# Altium schematic sheet 11 EXPANSION CN.SchDoc
size A3; Organization: Protel International P/L; Address1: L3, 12a Rodborough Rd; Address2: Frenchs Forest; Address3: NSW; Address4: Australia 2086; SheetNumber: 3; SheetTotal: 11
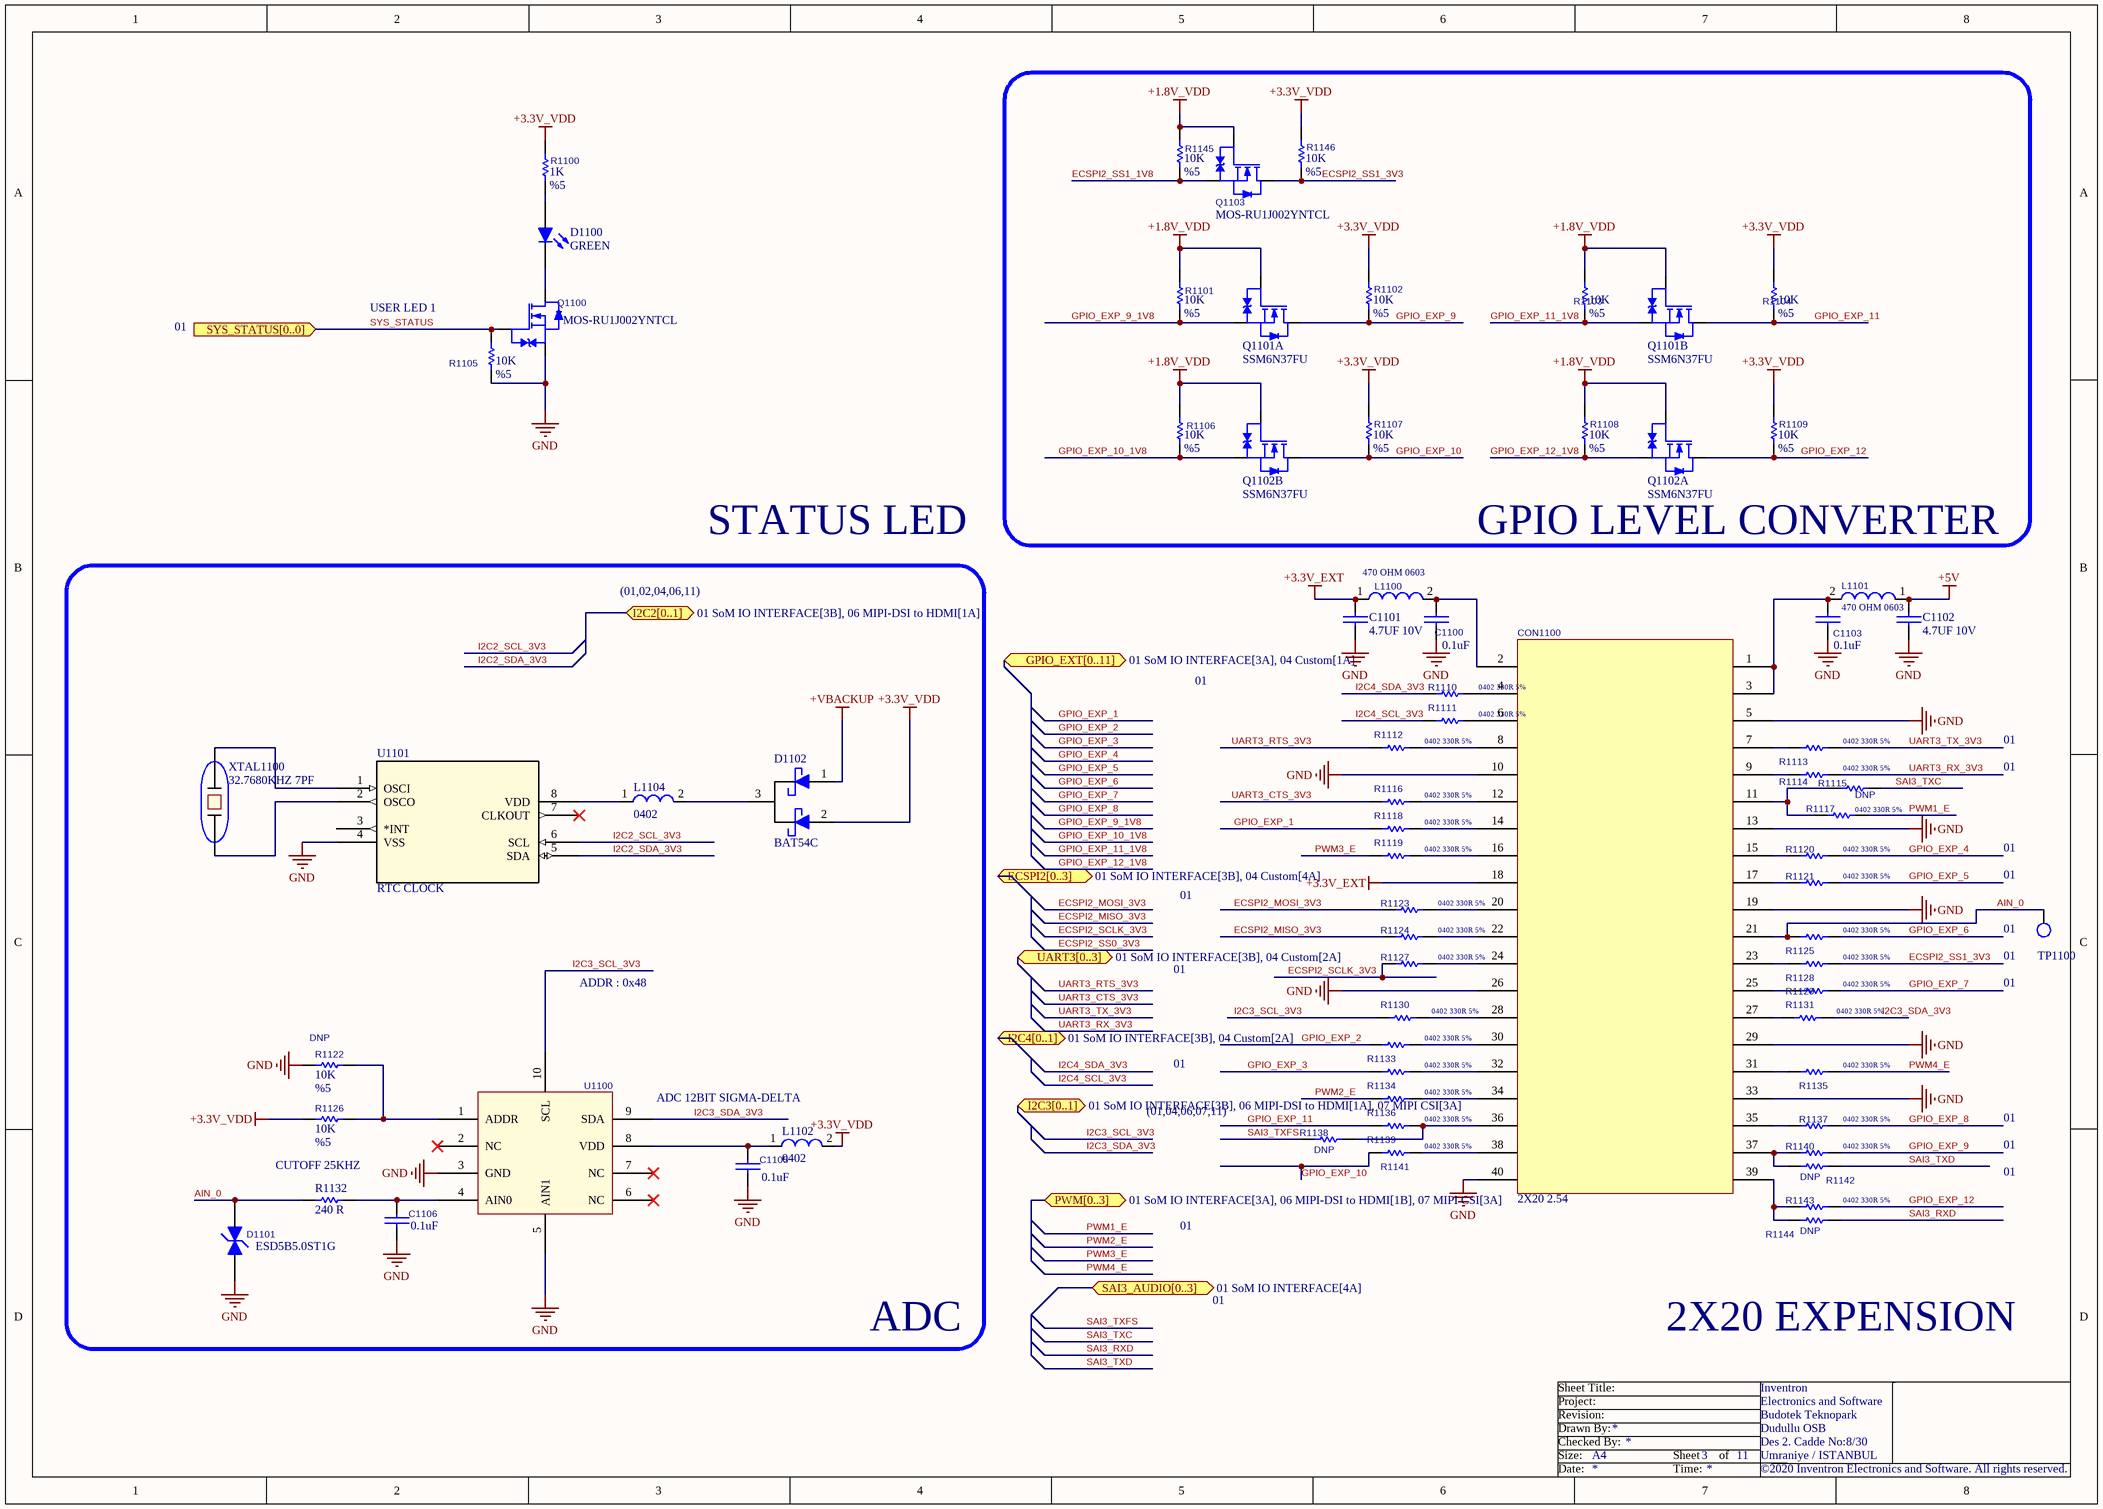
[diagram p0: 11 EXPANSION CN.SchDoc]

## Parts
C1100  0.1uF  [0402_CC]
C1101  4.7UF 10V  [0402_CC]
C1102  4.7UF 10V  [0402_CC]
C1103  0.1uF  [0402_CC]
C1105  0.1uF  [0402_CC]
C1106  0.1uF  [0402_CC]
CON1100  2X20 2.54  [HEADER 2.54mm X 2X20]
D1100  GREEN  [0603_LED]
D1101  ESD5B5.0ST1G  [SOD523 - SZESD]
D1102  BAT54C  [SOT23]
L1100  470 OHM 0603  [0603_RES]
L1101  470 OHM 0603  [0603_RES]
L1102  0402  [0402_RES]
L1104  0402  [0402_RES]
Q1100  MOS-RU1J002YNTCL  [SC-85-3/SOT-323FL]
Q1101  SSM6N37FU  [SOT-363]  (parts A,B of 2)
Q1102  SSM6N37FU  [SOT-363]  (parts A,B of 2)
Q1103  MOS-RU1J002YNTCL  [SC-85-3/SOT-323FL]
R1100  1K  Tolerance: %5  [0402_RES]
R1101  10K  Tolerance: %5  [0402_RES]
R1102  10K  Tolerance: %5  [0402_RES]
R1103  10K  Tolerance: %5  [0402_RES]
R1104  10K  Tolerance: %5  [0402_RES]
R1105  10K  Tolerance: %5  [0402_RES]
R1106  10K  Tolerance: %5  [0402_RES]
R1107  10K  Tolerance: %5  [0402_RES]
R1108  10K  Tolerance: %5  [0402_RES]
R1109  10K  Tolerance: %5  [0402_RES]
R1110  0402 330R 5%  [0402_RES]
R1111  0402 330R 5%  [0402_RES]
R1112  0402 330R 5%  [0402_RES]
R1113  0402 330R 5%  [0402_RES]
R1114  0402 330R 5%  [0402_RES]
R1115  ASSY_OPT: DNP  [0402_RES]  (hidden comment: 0402 330R 5%)  (no BOM)
R1116  0402 330R 5%  [0402_RES]
R1117  0402 330R 5%  [0402_RES]
R1118  0402 330R 5%  [0402_RES]
R1119  0402 330R 5%  [0402_RES]
R1120  0402 330R 5%  [0402_RES]
R1121  0402 330R 5%  [0402_RES]
R1122  10K  ASSY_OPT: DNP  Tolerance: %5  [0402_RES]  (no BOM)
R1123  0402 330R 5%  [0402_RES]
R1124  0402 330R 5%  [0402_RES]
R1125  0402 330R 5%  [0402_RES]
R1126  10K  Tolerance: %5  [0402_RES]
R1127  0402 330R 5%  [0402_RES]
R1128  0402 330R 5%  [0402_RES]
R1129  0402 330R 5%  [0402_RES]
R1130  0402 330R 5%  [0402_RES]
R1131  0402 330R 5%  [0402_RES]
R1132  240 R  [0402_RES]
R1133  0402 330R 5%  [0402_RES]
R1134  0402 330R 5%  [0402_RES]
R1135  0402 330R 5%  [0402_RES]
R1136  0402 330R 5%  [0402_RES]
R1137  0402 330R 5%  [0402_RES]
R1138  ASSY_OPT: DNP  [0402_RES]  (hidden comment: 0402 330R 5%)  (no BOM)
R1139  0402 330R 5%  [0402_RES]
R1140  0402 330R 5%  [0402_RES]
R1141  0402 330R 5%  [0402_RES]
R1142  ASSY_OPT: DNP  [0402_RES]  (hidden comment: 0402 330R 5%)  (no BOM)
R1143  0402 330R 5%  [0402_RES]
R1144  ASSY_OPT: DNP  [0402_RES]  (hidden comment: 0402 330R 5%)  (no BOM)
R1145  10K  Tolerance: %5  [0402_RES]
R1146  10K  Tolerance: %5  [0402_RES]
TP1100  TEST POINT 15  [testpoint_15]  (value not drawn)  (no BOM)
U1100  ADC 12BIT SIGMA-DELTA  [IC-TLA2022IRUGR]
U1101  RTC CLOCK  [PCF85063AT/AY]
XTAL1100  32.7680KHZ 7PF  [FC-135 32.768KA-AG0]

## Blocks framed on the sheet
GPIO LEVEL CONVERTER: Q1101-Q1103 R1101-R1104 R1106-R1109 R1145 R1146
ADC: C1105 C1106 D1101 D1102 L1102 L1104 R1122 R1126 R1132 U1100 U1101 XTAL1100

## Ports
ECSPI2[0..3] (bidir, see 01 SoM IO INTERFACE[3B], 04 Custom[4A]), GPIO_EXT[0..11] (bidir, see 01 SoM IO INTERFACE[3A], 04 Custom[1A]), I2C2[0..1] (bidir, see 01 SoM IO INTERFACE[3B], 06 MIPI-DSI to HDMI[1A]), I2C3[0..1] (bidir, see 01 SoM IO INTERFACE[3B], 06 MIPI-DSI to HDMI[1A], 07 MIPI CSI[3A]), I2C4[0..1] (bidir, see 01 SoM IO INTERFACE[3B], 04 Custom[2A]), PWM[0..3] (bidir, see 01 SoM IO INTERFACE[3A], 06 MIPI-DSI to HDMI[1B], 07 MIPI CSI[3A]), SAI3_AUDIO[0..3] (bidir, see 01 SoM IO INTERFACE[4A]), SYS_STATUS[0..0] (in), UART3[0..3] (bidir, see 01 SoM IO INTERFACE[3B], 04 Custom[2A])

## Nets
+1.8V_VDD: Q1101.2(G) Q1101.5(G) Q1102.2(G) Q1102.5(G) Q1103.1(G) R1101.2 R1103.2 R1106.2 R1108.2 R1145.2
+3.3V_EXT: C1101.1 CON1100.18 L1100.1
+3.3V_VDD: D1102.2 L1102.2 R1100.1 R1102.2 R1104.2 R1107.2 R1109.2 R1126.2 R1146.2
+5V: C1102.1 L1101.1
+VBACKUP: D1102.1
GND: C1100.2 C1101.2 C1102.2 C1103.2 C1105.2 C1106.1 CON1100.5 CON1100.10 CON1100.13 CON1100.19 CON1100.26 CON1100.29 CON1100.33 CON1100.40 D1101.1(A) Q1100.2(S) R1105.2 R1122.2 U1100.3(GND) U1100.5(AIN1) U1101.4(VSS)
AIN_0: CON1100.21 D1101.2(K) R1125.1 R1132.1 TP1100.1
ECSPI2_MISO_3V3: R1124.1
ECSPI2_MOSI_3V3: R1123.1
ECSPI2_SCLK_3V3: R1127.1
ECSPI2_SS1_1V8: Q1103.2(S) R1145.1
ECSPI2_SS1_3V3: Q1103.3(D) R1128.2 R1146.1
GPIO_EXP_1: R1118.1
GPIO_EXP_2: R1133.1
GPIO_EXP_3: R1134.1
GPIO_EXP_4: R1120.2
GPIO_EXP_5: R1121.2
GPIO_EXP_6: R1125.2
GPIO_EXP_7: R1131.2
GPIO_EXP_8: R1137.2
GPIO_EXP_9: Q1101.6(D) R1102.1 R1140.2
GPIO_EXP_9_1V8: Q1101.1(S) R1101.1
GPIO_EXP_10: Q1102.3(D) R1107.1 R1141.1
GPIO_EXP_10_1V8: Q1102.4(S) R1106.1
GPIO_EXP_11: Q1101.3(D) R1104.1 R1139.1
GPIO_EXP_11_1V8: Q1101.4(S) R1103.1
GPIO_EXP_12: Q1102.6(D) R1109.1 R1143.2
GPIO_EXP_12_1V8: Q1102.1(S) R1108.1
I2C2_SCL_3V3: U1101.6(SCL)
I2C2_SDA_3V3: U1101.5(SDA)
I2C3_SCL_3V3: R1130.1 U1100.10(SCL)
I2C3_SDA_3V3: R1129.2 U1100.9(SDA)
I2C4_SCL_3V3: R1111.1
I2C4_SDA_3V3: R1110.1
PWM1_E: R1117.2
PWM2_E: R1136.1
PWM3_E: R1119.1
PWM4_E: R1135.2
SAI3_RXD: R1144.2
SAI3_TXC: R1115.2
SAI3_TXD: R1142.2
SAI3_TXFS: R1138.1
SYS_STATUS: Q1100.1(G) R1105.1
UART3_CTS_3V3: R1116.1
UART3_RTS_3V3: R1112.1
UART3_RX_3V3: R1114.2
UART3_TX_3V3: R1113.2
NetC1100_1: C1100.1 CON1100.2 L1100.2
NetC1103_1: C1103.1 CON1100.1 CON1100.3 L1101.2
NetC1105_1: C1105.1 L1102.1 U1100.8(VDD)
NetC1106_2: C1106.2 R1132.2 U1100.4(AIN0)
NetCON1100_4: CON1100.4 R1110.2
NetCON1100_6: CON1100.6 R1111.2
NetCON1100_7: CON1100.7 R1113.1
NetCON1100_8: CON1100.8 R1112.2
NetCON1100_9: CON1100.9 R1114.1
NetCON1100_11: CON1100.11 R1115.1 R1117.1
NetCON1100_12: CON1100.12 R1116.2
NetCON1100_14: CON1100.14 R1118.2
NetCON1100_15: CON1100.15 R1120.1
NetCON1100_16: CON1100.16 R1119.2
NetCON1100_17: CON1100.17 R1121.1
NetCON1100_20: CON1100.20 R1123.2
NetCON1100_22: CON1100.22 R1124.2
NetCON1100_23: CON1100.23 R1128.1
NetCON1100_24: CON1100.24 R1127.2
NetCON1100_25: CON1100.25 R1131.1
NetCON1100_27: CON1100.27 R1129.1
NetCON1100_28: CON1100.28 R1130.2
NetCON1100_30: CON1100.30 R1133.2
NetCON1100_31: CON1100.31 R1135.1
NetCON1100_32: CON1100.32 R1134.2
NetCON1100_34: CON1100.34 R1136.2
NetCON1100_35: CON1100.35 R1137.1
NetCON1100_36: CON1100.36 R1138.2 R1139.2
NetCON1100_37: CON1100.37 R1140.1 R1142.1
NetCON1100_38: CON1100.38 R1141.2
NetCON1100_39: CON1100.39 R1143.1 R1144.1
NetD1100_1: D1100.1(A) R1100.2
NetD1100_2: D1100.2(K) Q1100.3(D)
NetD1102_3: D1102.3 L1104.2
NetL1104_1: L1104.1 U1101.8(VDD)
NetR1122_1: R1122.1 R1126.1 U1100.1(ADDR)
NetU1101_1: U1101.1(OSCI) XTAL1100.2
NetU1101_2: U1101.2(OSCO) XTAL1100.1

Not connected (* = marked no-connect by the designer): U1100 2(NC)* 6(NC)* 7(NC)*; U1101 3(*INT) 7(CLKOUT)*

## Notes on the sheet
- USER LED 1
- 01
- STATUS LED
- (01,02,04,06,11)
- (near TP1100) 01
- ADDR : 0x48
- (01,04,06,07,11)
- CUTOFF 25KHZ
- 2X20 EXPENSION
- Sheet Title:
- Inventron
- Size:
- Drawn By:
- Revision:
- Project:
- Checked By:
- A4
- Sheet
- of
- Budotek Teknopark
- Dudullu OSB
- Des 2. Cadde No:8/30
- Umraniye / ISTANBUL
- Electronics and Software
- Date:
- Time:
- ©2020 Inventron Electronics and Software. All rights reserved.

## Library data of the parts
C1100 C1103 C1105 C1106 = CAP-CL05B104KO5NNNC: CAP VER 0.1UF 16V X7R 0402; Manufacturer-1: SAMSUNG; Opt. Temp.: -55/+125; Class: Capacitor; Manufacturer Part Number-1: CL05B104KO5NNNC; Footprint: 0402; Manufacturer-2: *; Manufacturer Part Number-2: *; Inventron Stock No: *; Created By: LA; Created Date: 23.11.2018; Checked By: *; ASSY_OPT: *; Dimensions: *; Unit Price: 0,00499; Revision Date/Note: *; Price Break: 10K
C1101 C1102 = CAP-CL05A475MP5NRNC: CAP CER 4.7UF 10V X5R 0402; Manufacturer-1: Samsung Electro-Mechanics; Class: Capacitor; Manufacturer Part Number-1: CL05A475MP5NRNC; Footprint: 0402; Manufacturer-2: *; Manufacturer Part Number-2: *; Inventron Stock No: *; Created By: EE; Created Date: *; Checked By: *; ASSY_OPT: *; Dimensions: *; Unit Price: 5000; Revision Date/Note: *; Price Break: 0.01576; Opt. Temp.: *; Features: *
CON1100 = CON-L-KLS1-207-2-40-S: PIN HEADER 40PIN(2X20) 2.54mm THT V/T; Manufacturer-1: KLS; Class: Connector; Manufacturer Part Number-1: L-KLS1-207-2-40-S; Footprint: 2X40 2.54mm; Manufacturer-2: *; Manufacturer Part Number-2: *; Inventron Stock No: *; Created By: E.E; Created Date: 5.11.2020; Checked By: *; ASSY_OPT: *; Dimensions: *; Unit Price: *; Revision Date/Note: *; Price Break: *; Opt. Temp.: *; Features: *
D1100 = LED-LTST-C190KRKT: LED SMD 0603 SUPER GREEN; Manufacturer-1: LITEON; Manufacturer Part Number-1: LTST-C190KRKT; Footprint: *; Manufacturer-2: *; Manufacturer Part Number-2: *; Inventron Stock No: *; Created By: *; Created Date: *; Checked By: *; ASSY_OPT: *; Dimensions: *; Unit Price: 0.03343; Revision Date/Note: *; Price Break: 4000; Opt. Temp.: *; Class: Led; Features: *
D1101 = DIODE-ESD5B5.0ST1G: VS DIODE 5V SOD523; Manufacturer-1: ON Semiconductor; Opt. Temp.: -55/+150; Manufacturer Part Number-1: ESD5B5.0ST1G; Footprint: SOD-523; Manufacturer-2: *; Manufacturer Part Number-2: *; Inventron Stock No: *; Created By: E.E; Created Date: 3.11.2020; Checked By: *; ASSY_OPT: *; Dimensions: *; Unit Price: 0,0129; Revision Date/Note: *; Price Break: 3000; Class: Diode; Features: AUTOMOTIVE
D1102 = DIODE-BAT54C: DIODE ARRAY SCHOTTKY 30V SOT23-3; Manufacturer Part Number-1: BAT54ALT1G; Manufacturer-1: ON SEMI; Opt. Temp.: +125; Manufacturer-2: *; Manufacturer Part Number-2: *; Inventron Stock No: *; Created By: EE; Checked By: *; ASSY_OPT: *; Dimensions: *; Unit Price: 0,037; Revision Date/Note: *; Price Break: 100; Class: Diode
L1100 L1101 = IND-BLM18EG471SN1D: - Ferrite Bead 0603 (1608 Metric) 500mA 210mOhm; Manufacturer-1: Murata Electronics; Class: Inductor; Manufacturer Part Number-1: BLM18EG471SN1D; Footprint: 0603; Manufacturer-2: *; Manufacturer Part Number-2: *; Inventron Stock No: *; Created By: E.E; Created Date: 6.11.2020; Checked By: *; ASSY_OPT: *; Dimensions: *; Unit Price: *; Revision Date/Note: *; Price Break: *; Opt. Temp.: *; Features: *
L1102 L1104 = IND-FERRITE (RES 0 OHM) 0402: 0OHM 0402; Manufacturer Part Number-1: RMCF0402ZT0R00; Manufacturer-1: Stackpole Electronics Inc; Class: Inductor; Footprint: 0402; Manufacturer-2: *; Inventron Stock No: *; Created By: EE; Checked By: *; ASSY_OPT: *; Dimensions: *; Unit Price: 0.00186; Revision Date/Note: *; Price Break: 1000
Q1100 Q1103 = MOS-RU1J002YNTCL: MOSFET N-CH 50V 0.2A UMT3F; Manufacturer-1: ROHM; Opt. Temp.: -55/+150; Class: Transistor; Manufacturer Part Number-1: RU1J002YNTCL; Footprint: SC-85; Manufacturer-2: *; Manufacturer Part Number-2: *; Inventron Stock No: *; Created By: LA; Created Date: 23.11.2018; Checked By: *; ASSY_OPT: *; Dimensions: *; Unit Price: 0,0384; Revision Date/Note: *; Price Break: 3K
Q1101 Q1102 = MOS-N-SSM6N37FU,LF: MOSFET DUAL N-CHANNEL 20V 250MA SOT-363; Manufacturer-1: TOSHIBA; Opt. Temp.: -55°C ~ 150°C (TJ); Class: Transistor; Manufacturer Part Number-1: SSM6N37FU,LF; Manufacturer-2: *; Manufacturer Part Number-2: *; Inventron Stock No: *; Created By: OKS; Created Date: 26.05.2022; Checked By: *; ASSY_OPT: *; Dimensions: *; Unit Price: *; Revision Date/Note: *; Price Break: *; Features: *
R1100 = RES-RMCF0402JT1K00: RES 1K OHM 5% 1/16W 0402; Manufacturer-1: STACKPOLE; Opt. Temp.: -55/+155; Class: Resistor; Manufacturer Part Number-1: RMCF0402JT1K00; Footprint: 0402; Manufacturer-2: *; Manufacturer Part Number-2: *; Inventron Stock No: *; Created By: LA; Created Date: 23.11.2018; Checked By: *; ASSY_OPT: *; Dimensions: *; Unit Price: 0,00127; Revision Date/Note: *; Price Break: 10K
R1101-R1109 R1122 R1126 R1145 R1146 = RES-RMCF0402JT10K0: RES 10K OHM 5% 1/16W 0402; Manufacturer-1: STACKPOLE; Opt. Temp.: -55/+155; Class: Resistor; Manufacturer Part Number-1: RMCF0402JT10K0; Footprint: 0402; Manufacturer-2: *; Manufacturer Part Number-2: *; Inventron Stock No: *; Created By: LA; Created Date: 23.11.2018; Checked By: *; Dimensions: *; Unit Price: 0,00127; Revision Date/Note: *; Price Break: 10K
  R1101-R1109 R1126 R1145 R1146: ASSY_OPT: *
R1110-R1121 R1123-R1125 R1127-R1131 R1133-R1144 = RES-CRGCQ0402J330R: 330 ±5% 0.063W, 1/16W Chip Resistor 0402 (1005 Metric) Automotive AEC-Q200, Moisture Resistant Thick Film; Manufacturer-1: TE Connectivity Passive Product; Opt. Temp.: -55°C ~ 155°C; Tolerance: %5; Manufacturer Part Number-1: CRGCQ0402J330R; Footprint: 0402; Manufacturer-2: *; Manufacturer Part Number-2: *; Inventron Stock No: *; Created By: E.E; Created Date: 23.10.2020; Checked By: *; Dimensions: *; Unit Price: *; Revision Date/Note: *; Price Break: *; Class: Resistor
  R1110-R1114 R1116-R1121 R1123-R1125 R1127-R1131 R1133-R1137 R1139-R1141 R1143: ASSY_OPT: *
R1132 = RES-RMCF0402FT240R: RES 240 OHM %1 1/16W 0402; Manufacturer-1: STACKPOLE; Opt. Temp.: -55/+155; Class: Resistor; Manufacturer Part Number-1: RMCF0402FT240R; Footprint: 0402; Manufacturer-2: *; Manufacturer Part Number-2: *; Inventron Stock No: *; Created By: LA; Created Date: *; Checked By: *; ASSY_OPT: *; Dimensions: *; Unit Price: *; Revision Date/Note: *; Price Break: *; Features: AUTOMOTIVE; Tolerance: *
U1100 = IC-TLA2022IRUGR: 12 Bit Analog to Digital Converter 2 Input 1 Sigma-Delta 10-X2QFN (2x1.5); Manufacturer-1: Texas Instruments; Class: ICs; Manufacturer Part Number-1: TLA2022IRUGR; Footprint: 10-X2QFN; Manufacturer-2: *; Manufacturer Part Number-2: *; Inventron Stock No: *; Created By: E.E; Created Date: 8.11.2020; Checked By: *; ASSY_OPT: *; Dimensions: *; Unit Price: 0.5985; Revision Date/Note: *; Price Break: 3000; Opt. Temp.: *
U1101 = IC-PCF85063AT/AY: Real Time Clock (RTC) IC Clock/Calendar I²C, 2-Wire Serial 10-XFDFN Exposed Pad; Manufacturer-1: NXP USA Inc.; Opt. Temp.: -40 +85; Class: ICs; Manufacturer Part Number-1: PCF85063AT/AY; Footprint: 8-SOIC; Manufacturer-2: *; Manufacturer Part Number-2: *; Inventron Stock No: *; Created By: EE; Created Date: *; Checked By: *; ASSY_OPT: *; Dimensions: *; Unit Price: 0.37280; Revision Date/Note: *; Price Break: 1000
XTAL1100 = XTAL FC-135 32.768KA-AG0: 32.768kHz ±20ppm Crystal 7pF 70 kOhms 2-SMD, No Lead; Manufacturer-1: EPSON; Opt. Temp.: -20°C~+70°C; Manufacturer Part Number-1: FC-135 32.768KA-AG0; Manufacturer-2: *; Manufacturer Part Number-2: *; Inventron Stock No: *; Created By: E.E; Created Date: 20.10.20; Checked By: *; ASSY_OPT: *; Unit Price: 0.2; Revision Date/Note: *; Price Break: 1000; Class: Crystal; Features: *